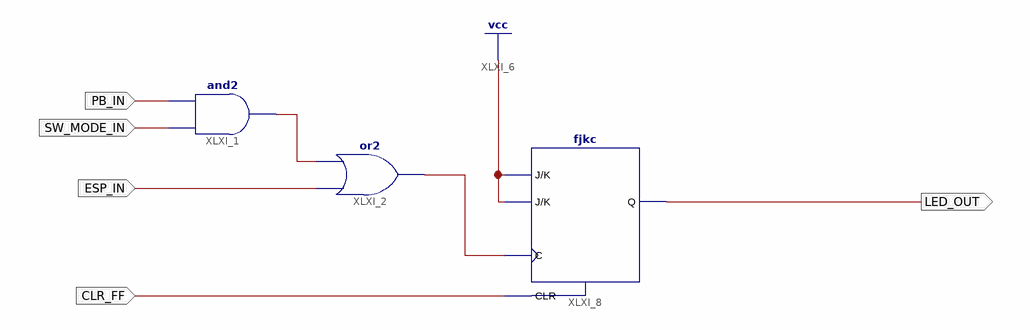
[diagram p0: schematic sheet 1]
// Xilinx ISE schematic Regular_LED_V2.sch (spartan6) as structural Verilog: 3 symbols, 5 ports
module Regular_LED_V2 (
  input  ESP_IN,
  input  SW_MODE_IN,
  input  PB_IN,
  input  CLR_FF,
  output LED_OUT
);

  wire XLXN_1, XLXN_15;

  and XLXI_1 (XLXN_1, SW_MODE_IN, PB_IN);
  or XLXI_2 (XLXN_15, ESP_IN, XLXN_1);
  fjkc XLXI_8 (.C(XLXN_15), .CLR(CLR_FF), .J(1'b1), .K(1'b1), .Q(LED_OUT));
endmodule
